# EAGLE schematic Pool Interface (FEATHER-ESP8266) (EAGLE 7.7.0)
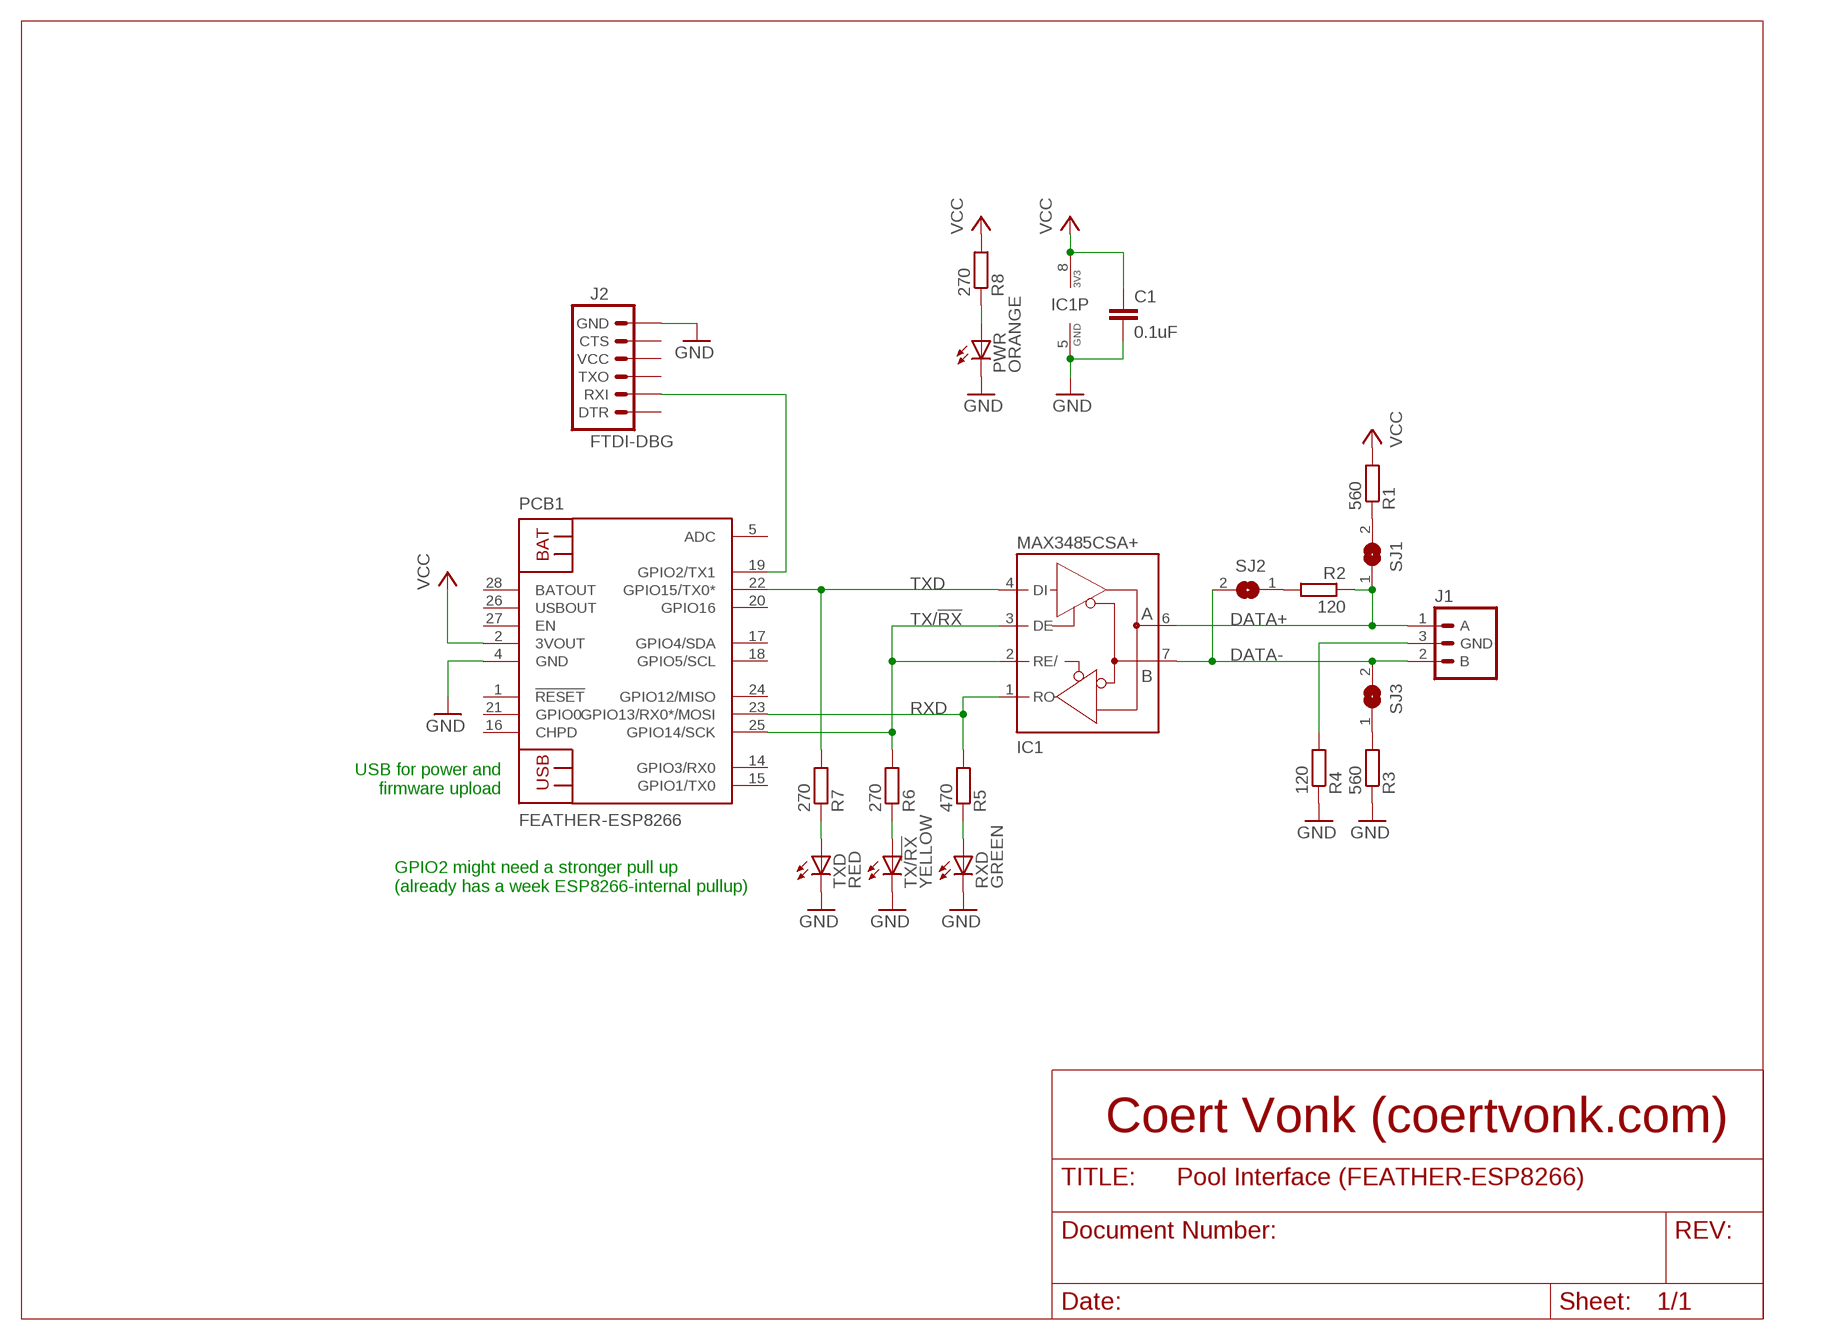
[diagram p0: schematic, sheet 1]

## Parts
C1  0.1uF  C-EUC0805K  [C0805K]
IC1  MAX3485CSA+  [SO08]
J1  RS485-CONSCREW  [SCREWTERMINAL-3.5MM-3]
J2  FTDI-DBG  ARDUINO_SERIAL_PROGRAMLONGPADS  [1X06_LONGPADS]
PCB1  FEATHER-ESP8266  [FEATHER-ESP8266]
PWR  ORANGE  LEDSML0805  [SML0805]
R1  560  R-EU_R0805  [R0805]
R2  120  R-EU_R0805  [R0805]
R3  560  R-EU_R0805  [R0805]
R4  120  R-EU_R0805  [R0805]
R5  470  R-EU_R0805  [R0805]
R6  270  R-EU_R0805  [R0805]
R7  270  R-EU_R0805  [R0805]
R8  270  R-EU_R0805  [R0805]
RXD  GREEN  LEDSML0805  [SML0805]
SJ1  SJ  [SJ]
SJ2  SJ  [SJ]
SJ3  SJ  [SJ]
TX/!RX  YELLOW  LEDSML0805  [SML0805]
TXD  RED  LEDSML0805  [SML0805]

## Nets
DATA+: IC1.6(A) J1.1(A) R2.1 SJ1.1
DATA-: IC1.7(B) J1.2(B) SJ2.2 SJ3.2
GND: C1.2 IC1.5(GND) J2.6(GND) PCB1.4(GND) PWR.C R3.1 R4.1 RXD.C TX/!RX.C TXD.C
N$1: J1.3(GND) R4.2
N$2: PWR.A R8.1
N$3: R5.1 RXD.A
N$4: R6.1 TX/!RX.A
N$5: R2.2 SJ2.1
N$6: R3.2 SJ3.1
N$7: R1.1 SJ1.2
N$10: J2.2(RXI) PCB1.19(GPIO2/TX1)
N$11: R7.1 TXD.A
RXD: IC1.1(RO) PCB1.23(GPIO13/RX0*/MOSI) R5.2
TX/!RX: IC1.2(RE/) IC1.3(DE) PCB1.25(GPIO14/SCK) R6.2
TXD: IC1.4(DI) PCB1.22(GPIO15/TX0*) R7.2
VCC: C1.1 IC1.8(5V) PCB1.2(3VOUT) R1.2 R8.2
Unconnected: J2.1(DTR) J2.3(TXO) J2.4(VCC) J2.5(CTS) PCB1.1(!RESET) PCB1.5(ADC) PCB1.14(GPIO3/RX0) PCB1.15(GPIO1/TX0) PCB1.16(CHPD) PCB1.17(GPIO4/SDA) PCB1.18(GPIO5/SCL) PCB1.20(GPIO16) PCB1.21(GPIO0) PCB1.24(GPIO12/MISO) PCB1.26(USBOUT) PCB1.27(EN) PCB1.28(BATOUT)

## Notes on the sheet
- USB for power and
  firmware upload
- GPIO2 might need a stronger pull up
  (already has a week ESP8266-internal pullup)
- Coert Vonk (coertvonk.com)

## Library data of the parts
C1 = rcl:C-EU: CAPACITOR, European symbol
IC1 = Coert Vonk:MAX3485CSA+: RS485 TRANSEIVER Datasheet <http://www.mouser.com/ds/2/256/MAX3483-MAX3491-76586.pdf> Order <http://www.mouser.com/Search/ProductDetail.aspx?R=MAX3485CSA%2bvirtualkey66880000virtualkey700-MAX3485CSA>; MF: MAXIM; MPN: MAX481CSA; OC_FARNELL: unknown; OC_NEWARK: 90C3817
J1 = Coert Vonk:RS485-CON: Header 3 Standard 3-pin 0.1" header. Use with straight break away headers (SKU : PRT-00116), right angle break away headers (PRT-00553), swiss pins (PRT-00743), machine pins (PRT-00117), and female headers (PRT-00115). Molex polarized connector foot print use with SKU : PRT-08232 with associated crimp pins and housings.; PROD_ID: CONN-08288
J2 = SparkFun-Connectors:ARDUINO_SERIAL_PROGRAM: FTDI connector footprints
PCB1 = Coert Vonk:FEATHER-ESP8266: Adafruit Feather HUZZAH ESP8266 ESP8266 WiFi development board with built in USB and battery charging. Source: https://www.adafruit.com/products/2821, https://learn.adafruit.com/adafruit-feather-huzzah-esp8266
PWR RXD TX/!RX TXD = led:LED: LED OSRAM: - CHIPLED LG R971, LG N971, LY N971, LG Q971, LY Q971, LO R971, LY R971 LH N974, LH R974 LS Q976, LO Q976, LY Q976 LO Q996 - Hyper CHIPLED LW Q18S LB Q993, LB Q99A, LB R99A - SideLED LS A670, LO A670, LY A670, LG A670, LP A670 LB A673, LV A673, LT A673, LW A673 LH A674 LY A675 LS A676, LA A676, LO A676, LY A676, LW A676 LS A679, LY A679, LG A679 - Hyper Micro SIDELED® LS Y876, LA Y876, LO Y876, LY Y876 LT Y87S - SmartLED LW L88C, LW L88S LB L89C, LB L89S, LG L890 LS L89K, LO L89K, LY L89K LS L896, LA L896, LO L896, LY L896 - TOPLED LS T670, LO T670, LY T670, LG T670, LP T670 LSG T670, LSP T670, LSY T670, LOP T670, LYG T670 LG T671, LOG T671, LSG T671 LB T673, LV T673, LT T673, LW T673 LH T674 LS T676, LA T676, LO T676, LY T676, LB T676, LH T676, LSB T676, LW T676 LB T67C, LV T67C, LT T67C, LS T67K, LO T67K, LY T67K, LW E67C LS E67B, LA E67B, LO E67B, LY E67B, LB E67C, LV E67C, LT E67C LW T67C LS T679, LY T679, LG T679 LS T770, LO T770, LY T770, LG T770, LP T770 LB T773, LV T773, LT T773, LW T773 LH T774 LS E675, LA E675, LY E675, LS T675 LS T776, LA T776, LO T776, LY T776, LB T776 LHGB T686 LT T68C, LB T68C - Hyper Mini TOPLED® LB M676 - Mini TOPLED Santana® LG M470 LS M47K, LO M47K, LY M47K Source: http://www.osram.convergy.de LUXEON: - LUMILED® LXK2-PW12-R00, LXK2-PW12-S00, LXK2-PW14-U00, LXK2-PW14-V00 LXK2-PM12-R00, LXK2-PM12-S00, LXK2-PM14-U00 LXK2-PE12-Q00, LXK2-PE12-R00, LXK2-PE12-S00, LXK2-PE14-T00, LXK2-PE14-U00 LXK2-PB12-K00, LXK2-PB12-L00, LXK2-PB12-M00, LXK2-PB14-N00, LXK2-PB14-P00, LXK2-PB14-Q00 LXK2-PR12-L00, LXK2-PR12-M00, LXK2-PR14-Q00, LXK2-PR14-R00 LXK2-PD12-Q00, LXK2-PD12-R00, LXK2-PD12-S00 LXK2-PH12-R00, LXK2-PH12-S00 LXK2-PL12-P00, LXK2-PL12-Q00, LXK2-PL12-R00 Source: www.luxeon.com KINGBRIGHT: KA-3528ASYC Source: www.kingbright.com
R1-R8 = rcl:R-EU_: RESISTOR, European symbol
SJ1-SJ3 = jumper:SJ: SMD solder JUMPER